# Altium schematic sheet 02-CPU.SchDoc
size A4; 学校: 辽宁工程技术大学; 考号: 2107010403; 证件号: 532124200305070711; 图号: 第1幅; 图号数: 总共7幅; SheetNumber: 2; SheetTotal: 6; 单位名称: 辽宁工程技术大学; 身份证号: 532124200305070711; 姓名: 邓祥涛; 图名: mydesign; 选手编号: 84011514
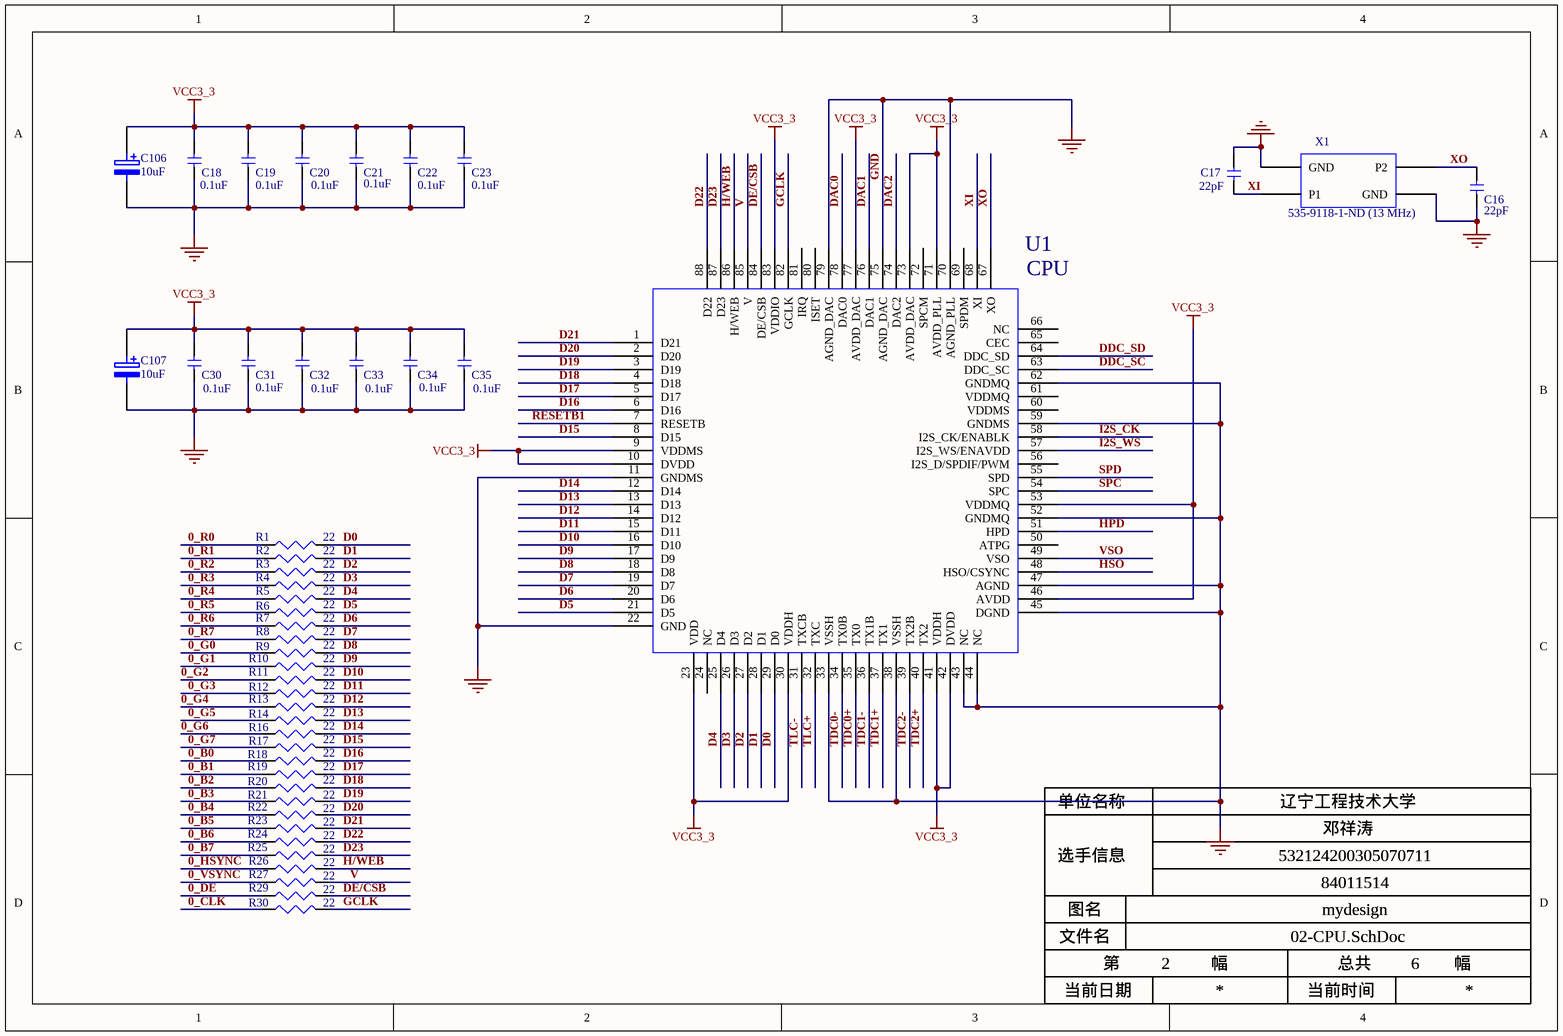
[diagram p0: 02-CPU.SchDoc]

## Parts
C16  value 22pF  [C0603]  (hidden comment: C_2)
C17  value 22pF  [C0603]  (hidden comment: C_2)
C18  value 0.1uF  [C0603]  (hidden comment: C_2)
C19  value 0.1uF  [C0603]  (hidden comment: C_2)
C20  value 0.1uF  [C0603]  (hidden comment: C_2)
C21  value 0.1uF  [C0603]  (hidden comment: C_2)
C22  value 0.1uF  [C0603]  (hidden comment: C_2)
C23  value 0.1uF  [C0603]  (hidden comment: C_2)
C30  value 0.1uF  [C0603]  (hidden comment: C_2)
C31  value 0.1uF  [C0603]  (hidden comment: C_2)
C32  value 0.1uF  [C0603]  (hidden comment: C_2)
C33  value 0.1uF  [C0603]  (hidden comment: C_2)
C34  value 0.1uF  [C0603]  (hidden comment: C_2)
C35  value 0.1uF  [C0603]  (hidden comment: C_2)
C106  10uF  [3528-C]
C107  10uF  [3528-C]
R1  value 22  [R0603]  (hidden comment: RESISTOR_2)
R2  value 22  [R0603]  (hidden comment: RESISTOR_2)
R3  value 22  [R0603]  (hidden comment: RESISTOR_2)
R4  value 22  [R0603]  (hidden comment: RESISTOR_2)
R5  value 22  [R0603]  (hidden comment: RESISTOR_2)
R6  value 22  [R0603]  (hidden comment: RESISTOR_2)
R7  value 22  [R0603]  (hidden comment: RESISTOR_2)
R8  value 22  [R0603]  (hidden comment: RESISTOR_2)
R9  value 22  [R0603]  (hidden comment: RESISTOR_2)
R10  value 22  [R0603]  (hidden comment: RESISTOR_2)
R11  value 22  [R0603]  (hidden comment: RESISTOR_2)
R12  value 22  [R0603]  (hidden comment: RESISTOR_2)
R13  value 22  [R0603]  (hidden comment: RESISTOR_2)
R14  value 22  [R0603]  (hidden comment: RESISTOR_2)
R16  value 22  [R0603]  (hidden comment: RESISTOR_2)
R17  value 22  [R0603]  (hidden comment: RESISTOR_2)
R18  value 22  [R0603]  (hidden comment: RESISTOR_2)
R19  value 22  [R0603]  (hidden comment: RESISTOR_2)
R20  value 22  [R0603]  (hidden comment: RESISTOR_2)
R21  value 22  [R0603]  (hidden comment: RESISTOR_2)
R22  value 22  [R0603]  (hidden comment: RESISTOR_2)
R23  value 22  [R0603]  (hidden comment: RESISTOR_2)
R24  value 22  [R0603]  (hidden comment: RESISTOR_2)
R25  value 22  [R0603]  (hidden comment: RESISTOR_2)
R26  value 22  [R0603]  (hidden comment: RESISTOR_2)
R27  value 22  [R0603]  (hidden comment: RESISTOR_2)
R29  value 22  [R0603]  (hidden comment: RESISTOR_2)
R30  value 22  [R0603]  (hidden comment: RESISTOR_2)
U1  value CPU  [QFN88]  (hidden comment: LQFP80_5)
X1  value 535-9118-1-ND (13 MHz)  [SMD-7050]  (hidden comment: 535-9118-1-ND)

## Nets
GND: C16.1 C17.1 C18.1 C19.1 C20.1 C21.1 C22.1 C23.1 C30.1 C31.1 C32.1 C33.1 C34.1 C35.1 C106.2 C107.2 U1.11(GNDMS) U1.22(GND) U1.33(VSSH) U1.38(VSSH) U1.43(NC) U1.44(NC) U1.45(DGND) U1.47(AGND) U1.52(GNDMQ) U1.59(GNDMS) U1.62(GNDMQ) U1.70(AGND_PLL) U1.75(AGND_DAC) U1.79(AGND_DAC) X1.2(GND) X1.4(GND)
VCC3_3: C18.2 C19.2 C20.2 C21.2 C22.2 C23.2 C30.2 C31.2 C32.2 C33.2 C34.2 C35.2 C106.1 C107.1 U1.9(VDDMS) U1.10(DVDD) U1.23(VDD) U1.30(VDDH) U1.41(VDDH) U1.42(DVDD) U1.46(AVDD) U1.53(VDDMQ) U1.71(AVDD_PLL) U1.73(AVDD_DAC) U1.77(AVDD_DAC) U1.83(VDDIO)
0_B0: R18.1
0_B1: R19.1
0_B2: R20.1
0_B3: R21.1
0_B4: R22.1
0_B5: R23.1
0_B6: R24.1
0_B7: R25.1
0_CLK: R30.1
0_DE: R29.1
0_G0: R9.1
0_G1: R10.1
0_G2: R11.1
0_G3: R12.1
0_G4: R13.1
0_G5: R14.1
0_G6: R16.1
0_G7: R17.1
0_HSYNC: R26.1
0_R0: R1.1
0_R1: R2.1
0_R2: R3.1
0_R3: R4.1
0_R4: R5.1
0_R5: R6.1
0_R6: R7.1
0_R7: R8.1
0_VSYNC: R27.1
D0: R1.2 U1.29(D0)
D1: R2.2 U1.28(D1)
D2: R3.2 U1.27(D2)
D3: R4.2 U1.26(D3)
D4: R5.2 U1.25(D4)
D5: R6.2 U1.21(D5)
D6: R7.2 U1.20(D6)
D7: R8.2 U1.19(D7)
D8: R9.2 U1.18(D8)
D9: R10.2 U1.17(D9)
D10: R11.2 U1.16(D10)
D11: R12.2 U1.15(D11)
D12: R13.2 U1.14(D12)
D13: R14.2 U1.13(D13)
D14: R16.2 U1.12(D14)
D15: R17.2 U1.8(D15)
D16: R18.2 U1.6(D16)
D17: R19.2 U1.5(D17)
D18: R20.2 U1.4(D18)
D19: R21.2 U1.3(D19)
D20: R22.2 U1.2(D20)
D21: R23.2 U1.1(D21)
D22: R24.2 U1.88(D22)
D23: R25.2 U1.87(D23)
DAC0: U1.78(DAC0)
DAC1: U1.76(DAC1)
DAC2: U1.74(DAC2)
DDC_SC: U1.63(DDC_SC)
DDC_SD: U1.64(DDC_SD)
DE/CSB: R29.2 U1.84(DE/CSB)
GCLK: R30.2 U1.82(GCLK)
H/WEB: R26.2 U1.86(H/WEB)
HPD: U1.51(HPD)
HSO: U1.48(HSO/CSYNC)
I2S_CK: U1.58(I2S_CK/ENABLK)
I2S_WS: U1.57(I2S_WS/ENAVDD)
RESETB1: U1.7(RESETB)
SPC: U1.54(SPC)
SPD: U1.55(SPD)
TDC0+: U1.35(TX0)
TDC0-: U1.34(TX0B)
TDC1+: U1.37(TX1)
TDC1-: U1.36(TX1B)
TDC2+: U1.40(TX2)
TDC2-: U1.39(TX2B)
TLC+: U1.32(TXC)
TLC-: U1.31(TXCB)
V: R27.2 U1.85(V)
VSO: U1.49(VSO)
XI: C17.2 U1.68(XI) X1.1(P1)
XO: C16.2 U1.67(XO) X1.3(P2)

Not connected (* = marked no-connect by the designer): U1 24(NC) 50(ATPG) 56(I2S_D/SPDIF/PWM) 60(VDDMS) 61(VDDMQ) 65(CEC) 66(NC) 69(SPDM) 72(SPCM) 80(ISET) 81(IRQ)

## Notes on the sheet
- 单位名称
- 选手信息
- 图名
- 文件名
- 当前日期
- 第
- 幅
- 当前时间
- 总共

## Library data of the parts
C16-C23 C30-C35 = C_2: PCB DECAL: 0603; SOURCE_PATH: C:\ORCAD\ORCAD_10.0\TOOLS\CAPTURE\LIBRARY\PSPICE\ANALOG.OLB; DIST: FLAT; PSPICETEMPLATE: C^@REFDES %1 %2 ?TOLERANCE|C^@REFDES| @VALUE ?IC/IC=@IC/ ?TOLERANCE|\n.model C^@REFDES CAP C=1 DEV=@TOLERANCE%|; VOLTAGE: CMAX; CURRENT: CIMAX; KNEE: CBMAX; SLOPE: CSMAX; MAX_TEMP: CTMAX
C106 C107 = ELECTRO2: Electrolytic Capacitor
R1-R14 R16-R27 R29 R30 = RESISTOR_2: PCB DECAL: 0603; SOURCE_PATH: C:\ORCADWIN\CAPTURE\LIBRARY\PCBDEV.OLB
U1 = LQFP80_5: SOURCE_PATH: C:\DOCUME~1\CAD01\桌面\TEST\0622\HDMI_B~1.DSN; PCB DECAL: QFN88
X1 = 535-9118-1-ND: SOURCE_PATH: C:\CHRONTEL\PCB\STEPHEN.OLB; PCB DECAL: SMD-7050